# Altium schematic sheet Imaging_Sensor.SchDoc
size A
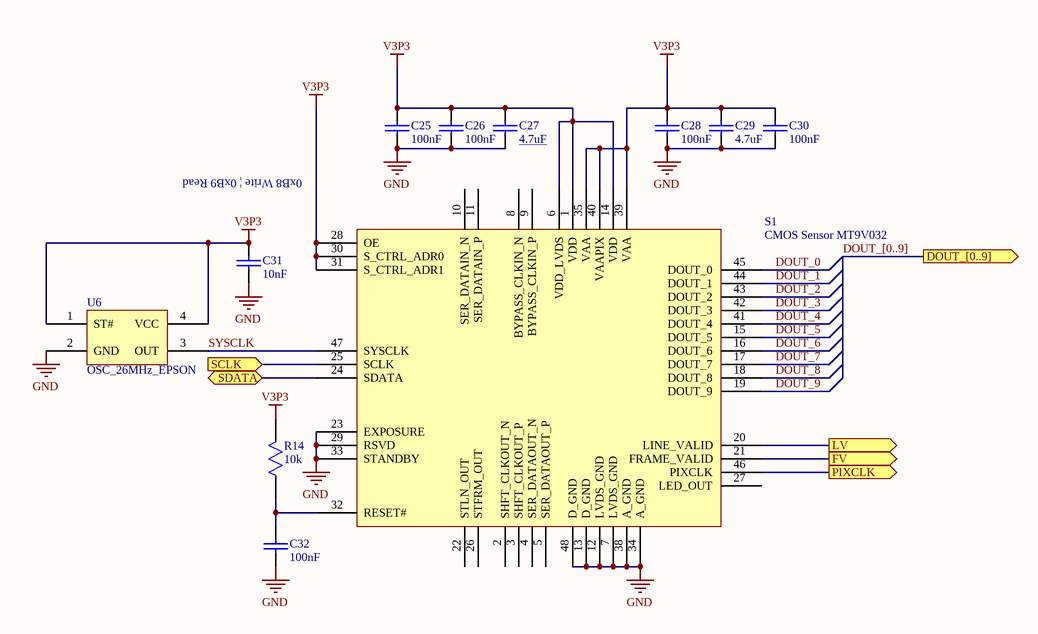
[diagram p0: Imaging_Sensor.SchDoc]

## Parts
C25  100nF  [SMD CAP 0402]
C26  100nF  [SMD CAP 0402]
C27  4.7uF  [SMD CAP 0402]
C28  100nF  [SMD CAP 0402]
C29  4.7uF  [SMD CAP 0402]
C30  100nF  [SMD CAP 0402]
C31  10nF  [SMD CAP 0402]
C32  100nF  [SMD CAP 0402]
R14  10k  [SMD RES 0402]
S1  CMOS Sensor MT9V032  [CMOS Sensor MT9V032_HD]
U6  OSC_26MHz_EPSON  [OSC SG_211SCE 26MHz]

## Ports
DOUT_[0..9] (out), FV (out), LV (out), PIXCLK (out), SCLK (in), SDATA (bidir)

## Nets
GND: C25.1 C26.1 C27.1 C28.1 C29.1 C30.1 C31.1 C32.1 S1.7(LVDS_GND) S1.12(LVDS_GND) S1.13(D_GND) S1.23(EXPOSURE) S1.29(RSVD) S1.33(STANDBY) S1.34(A_GND) S1.38(A_GND) S1.48(D_GND) U6.2(GND)
V3P3: C25.0 C26.0 C27.0 C28.0 C29.0 C30.0 C31.0 R14.1 S1.1(VDD) S1.6(VDD_LVDS) S1.14(VDD) S1.28(OE) S1.30(S_CTRL_ADR0) S1.31(S_CTRL_ADR1) S1.35(VAA) S1.39(VAA) S1.40(VAAPIX) U6.1(ST#) U6.4(VCC)
DOUT_0: S1.45(DOUT_0)
DOUT_1: S1.44(DOUT_1)
DOUT_2: S1.43(DOUT_2)
DOUT_3: S1.42(DOUT_3)
DOUT_4: S1.41(DOUT_4)
DOUT_5: S1.15(DOUT_5)
DOUT_6: S1.16(DOUT_6)
DOUT_7: S1.17(DOUT_7)
DOUT_8: S1.18(DOUT_8)
DOUT_9: S1.19(DOUT_9)
FV: S1.21(FRAME_VALID) ; port FV
LV: S1.20(LINE_VALID) ; port LV
PIXCLK: S1.46(PIXCLK) ; port PIXCLK
SCLK: S1.25(SCLK) ; port SCLK
SDATA: S1.24(SDATA) ; port SDATA
SYSCLK: S1.47(SYSCLK) U6.3(OUT)
NetC32_0: C32.0 R14.0 S1.32(RESET#)

Not connected (* = marked no-connect by the designer): S1 2(SHFT_CLKOUT_N) 3(SHFT_CLKOUT_P) 4(SER_DATAOUT_N) 5(SER_DATAOUT_P) 8(BYPASS_CLKIN_N) 9(BYPASS_CLKIN_P) 10(SER_DATAIN_N) 11(SER_DATAIN_P) 22(STLN_OUT) 26(STFRM_OUT) 27(LED_OUT)

## Buses and harness runs
bus DOUT_[0..9] = port DOUT_[0..9]

## Notes on the sheet
- 0xB8 Write | 0xB9 Read

## Library data of the parts
C25-C32 = Capacitor: Value: C?
R14 = Resistor: Value: ?